# EAGLE design arm_arduinoboard (EAGLE 7.3.0)
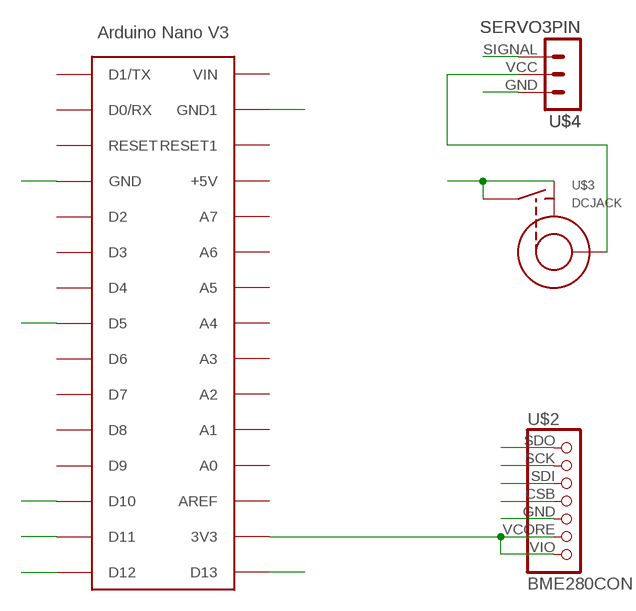
[diagram p0: schematic, sheet 1]

## Parts
U$1  ARDUINO_NANO  [ARDUINO_NANO]
U$2  BME280CON  [BME280CON]
U$3  DCJACK  [DCJACK]
U$4  SERVO3PIN  [SERVO3PIN]

## Nets
CSB: U$1.D10 U$2.CSB
GND: U$1.GND U$1.GND1 U$2.GND U$3.P$2(TIP) U$3.P$3(SHUNT) U$4.GND
N$1: U$1.3V3 U$2.VCORE U$2.VIO
N$2: U$3.P$1(CENTER) U$4.VCC
SCK: U$1.D13 U$2.SCK
SDI: U$1.D11 U$2.SDI
SDO: U$1.D12 U$2.SDO
SIGNAL: U$1.D5 U$4.SIGNAL
Unconnected: U$1.+5V U$1.A0(A7) U$1.A1(A6) U$1.A2(A5) U$1.A3(A4) U$1.A4(A3) U$1.A5(A2) U$1.A6(A1) U$1.A7(A0) U$1.AREF U$1.D0/RX U$1.D1/TX U$1.D2 U$1.D3 U$1.D4 U$1.D6 U$1.D7 U$1.D8 U$1.D9 U$1.RESET U$1.RESET1 U$1.VIN

## Library data of the parts
U$1 = APC_arm_arduinoboard:ARDUINO_NANO
U$2 = APC_arm_arduinoboard:BME280CON
U$3 = APC_arm_arduinoboard:DCJACK
U$4 = APC_arm_arduinoboard:SERVO3PIN

## Board
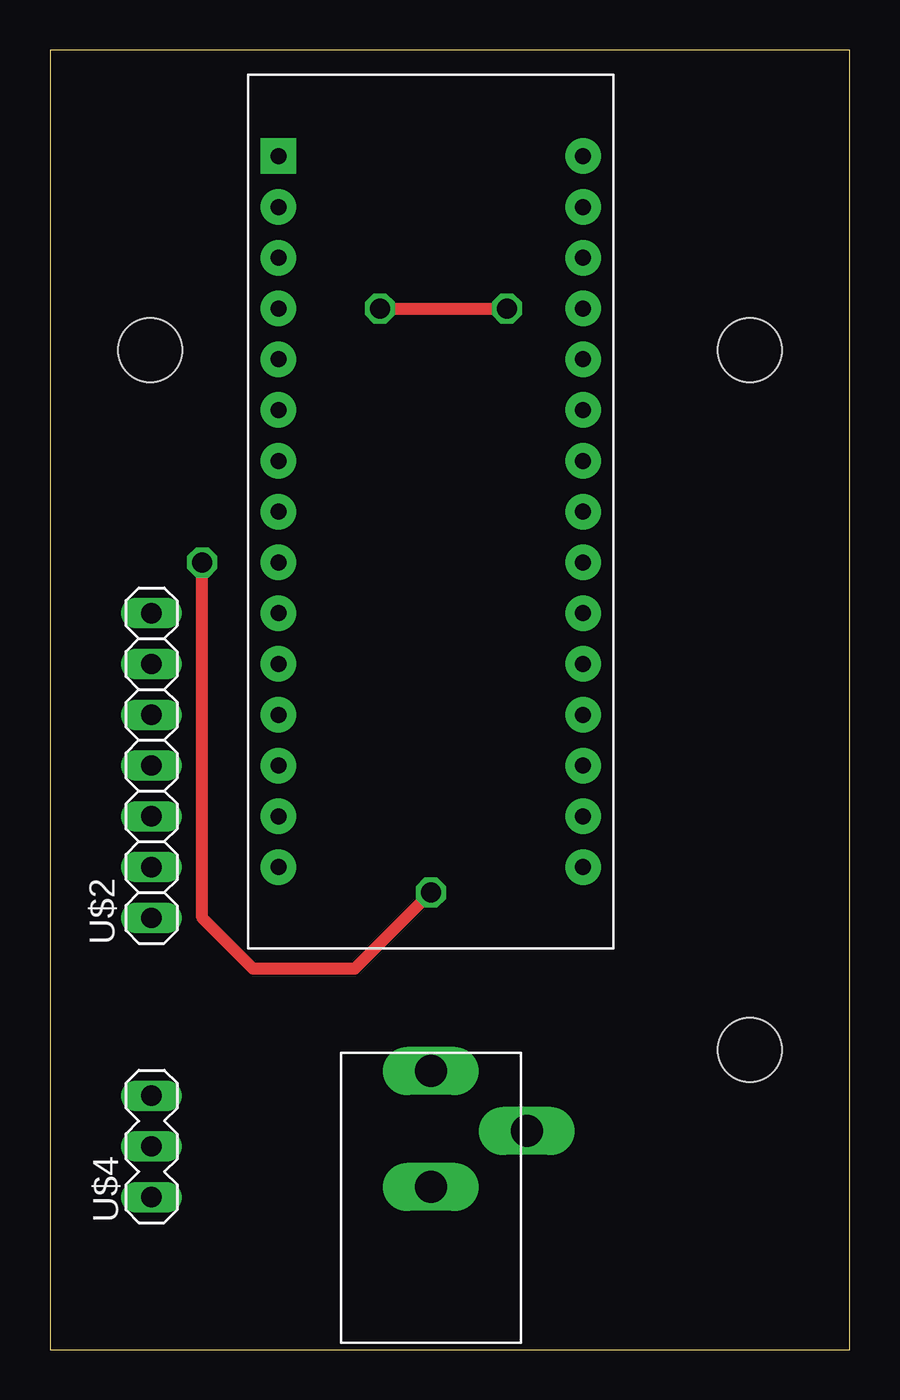
[diagram p1: board, top side]
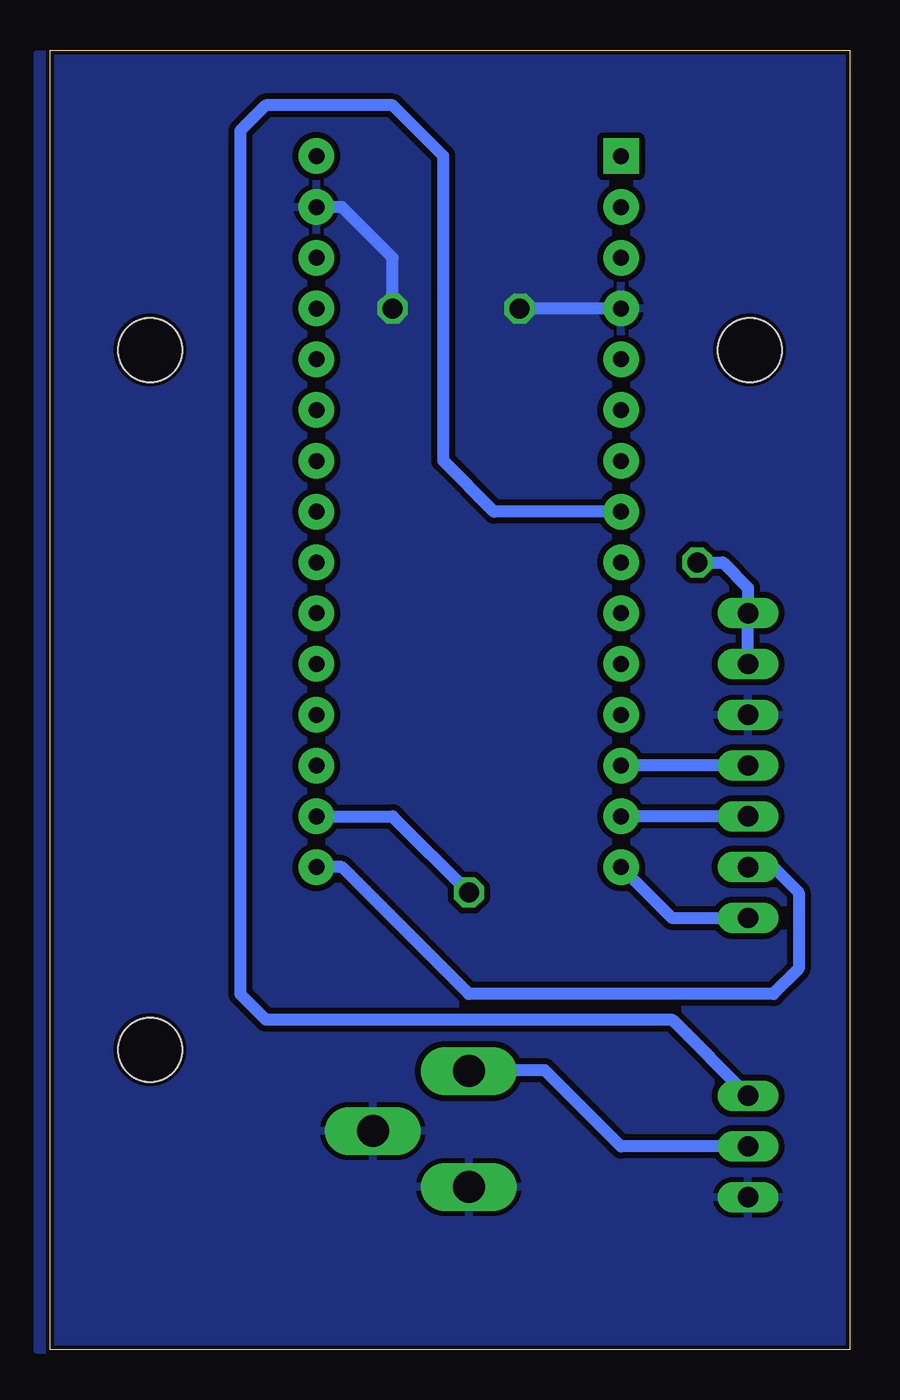
[diagram p2: board, bottom side, seen from below]

Size 40 x 65 mm. Coordinates in mm from the lower left corner, seen from the top.
Outline: 0,0 40,0 40,65 0,65 0,0
Copper layers (1*16): Top 0.0356mm / dielectric 1.5011mm / Bottom 0.0356mm
Design rules "formita": minimum track width 10mil, minimum drill 0.5994mm, track to track 0.3mm, track to pad 0.3mm, pad to pad 0.3mm, via to via 0.3mm, smd to smd 8mil, copper to edge 8mil, drill to drill 8mil, minimum pad ring 10mil, minimum via ring 8mil, stop-mask expansion 4mil, vias tented up to drill 0mil, thermal gap 10mil
Holes 3.2 mm at 5,50 35,50 35,15

### Footprints (pad centres in the part's own frame; a part is rotated, then mirrored left to right if it is on the bottom)
ARDUINO_NANO = drill 0.8 pad 1.778: 3V3 7.62,-15.24; +5V 7.62,10.16; A0 7.62,7.62; A1 7.62,5.08; A2 7.62,2.54; A3 7.62,0; A4 7.62,-2.54; A5 7.62,-5.08; A6 7.62,-7.62; A7 7.62,-10.16; AREF 7.62,-12.7; D0/RX -7.62,15.24; D2 -7.62,7.62; D3 -7.62,5.08; D4 -7.62,2.54; D5 -7.62,0; D6 -7.62,-2.54; D7 -7.62,-5.08; D8 -7.62,-7.62; D9 -7.62,-10.16; D10 -7.62,-12.7; D11 -7.62,-15.24; D12 -7.62,-17.78; D13 7.62,-17.78; GND -7.62,10.16; GND1 7.62,15.24; RESET -7.62,12.7; RESET1 7.62,12.7; VIN 7.62,17.78 | drill 0.8 pad 1.778 square: D1/TX -7.62,17.78
BME280CON = drill 1.016 long: CSB 0,0; GND 2.54,0; SCK -5.08,0; SDI -2.54,0; SDO -7.62,0; VCORE 5.08,0; VIO 7.62,0
DCJACK = drill 1.6 long: P$1 5.8,1.27; P$2 0,1.27; P$3 2.8,-3.53
SERVO3PIN = drill 1.016 long: GND -2.54,0; SIGNAL 2.54,0; VCC 0,0

### Placement (x,y rotation side)
U$1  19.05,41.91 0 top
U$2  5.08,29.21 90 top
U$3  20.32,8.13 90 top
U$4  5.08,10.16 90 top

### Tracks (layer width: path | path; a pad name or v marks a point on that pad's centre or on a via)
CSB
  Bottom 0.61: U$2.CSB U$1.D10
GND  (via drill 1)
  Top 0.61: v16.51,52.07 v22.86,52.07
  Bottom 0.61: U$1.GND v16.51,52.07 | v22.86,52.07 22.86,54.61 25.4,57.15 U$1.GND1
  pour Bottom: 0,64.77 40.64,64.77 40.64,0 0,0
N$1  (via drill 1)
  Top 0.61: v19.05,22.86 15.24,19.05 10.16,19.05 7.62,21.59 v7.62,39.37
  Bottom 0.61: U$2.VCORE U$2.VIO 5.08,38.1 6.35,39.37 v7.62,39.37 | U$1.3V3 22.86,26.67 v19.05,22.86
N$2
  Bottom 0.61: U$4.VCC 11.43,10.16 15.24,13.97 19.01,13.97 U$3.P$1
SCK
  Bottom 0.61: U$2.SCK 3.81,24.13 2.54,22.86 2.54,19.05 3.81,17.78 19.05,17.78 25.4,24.13 U$1.D13
SDI
  Bottom 0.61: U$2.SDI U$1.D11
SDO
  Bottom 0.61: U$1.D12 8.89,21.59 U$2.SDO
SIGNAL
  Bottom 0.61: U$1.D5 17.78,41.91 20.32,44.45 20.32,59.69 22.86,62.23 29.21,62.23 30.48,60.96 30.48,17.78 29.21,16.51 8.89,16.51 U$4.SIGNAL